# Altium schematic sheet External Power Connectors.SchDoc
size A4; SheetNumber: 16; SheetTotal: 16
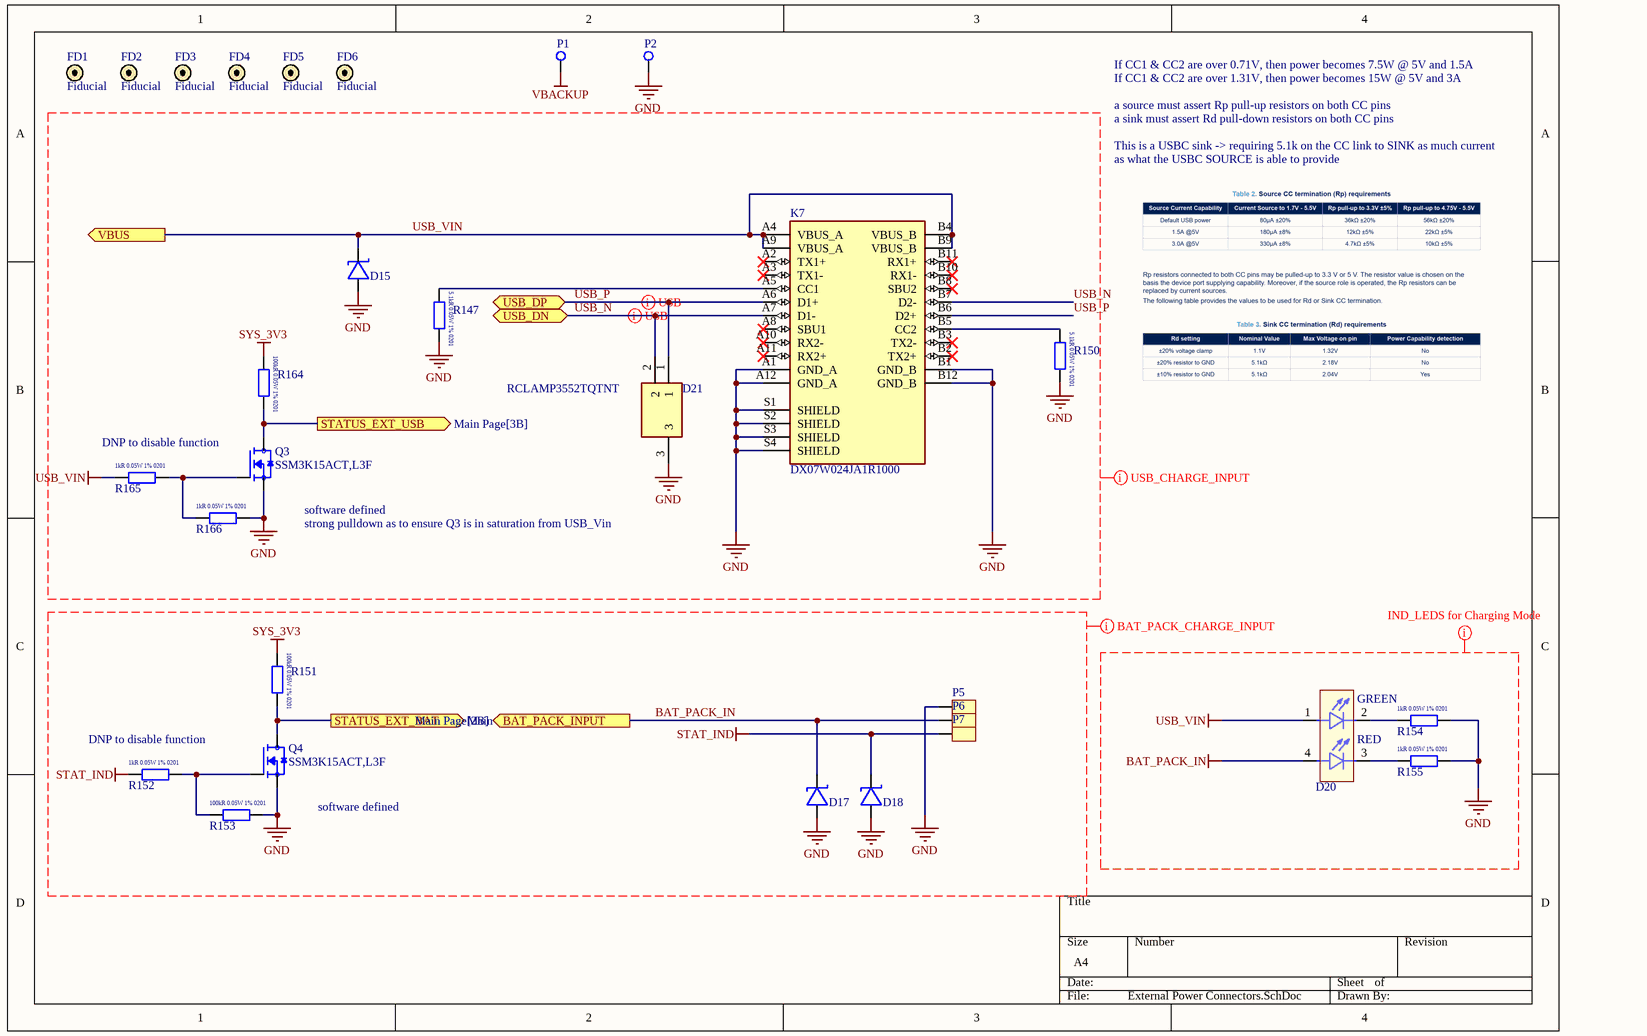
[diagram p0: External Power Connectors.SchDoc]

## Parts
D15  RCLAMP04041PW.C  [RCLAMP04041PW.C]  (value not drawn)
D17  RCLAMP04041PW.C  [RCLAMP04041PW.C]  (value not drawn)
D18  RCLAMP04041PW.C  [RCLAMP04041PW.C]  (value not drawn)
D20  APGB0607G22R23C  [LED_APGB0607G22R23C]  (value not drawn)
D21  RCLAMP3552TQTNT  [RCLAMP3552TQTNT]
FD1  Fiducial  [Fiducial]
FD2  Fiducial  [Fiducial]
FD3  Fiducial  [Fiducial]
FD4  Fiducial  [Fiducial]
FD5  Fiducial  [Fiducial]
FD6  Fiducial  [Fiducial]
K7  DX07W024JA1R1000  [JAE_DX07W024JA1R1000]
P1  Pogo pin Pad  [S70-220101045R]  (value not drawn)
P2  Pogo pin Pad  [S70-220101045R]  (value not drawn)
P5  Pad for Bat  [Pad for Bat]  (value not drawn)
P6  Pad for Bat  [Pad for Bat]  (value not drawn)
P7  Pad for Bat  [Pad for Bat]  (value not drawn)
Q3  SSM3K15ACT,L3F  [SSM3K15ACT]
Q4  SSM3K15ACT,L3F  [SSM3K15ACT]
R147  ERJ-1GNF5101C  [RESC0603X03L]  (value not drawn)
R150  ERJ-1GNF5101C  [RESC0603X03L]  (value not drawn)
R151  ERJ-1GNF1003C  [RESC0603X03L]  (value not drawn)
R152  ERJ-1GNF1001C  [RESC0603X03L]  (value not drawn)
R153  ERJ-1GNF1003C  [RESC0603X03L]  (value not drawn)
R154  ERJ-1GNF1001C  [RESC0603X03L]  (value not drawn)
R155  ERJ-1GNF1001C  [RESC0603X03L]  (value not drawn)
R164  ERJ-1GNF1003C  [RESC0603X03L]  (value not drawn)
R165  ERJ-1GNF1001C  [RESC0603X03L]  (value not drawn)
R166  ERJ-1GNF1001C  [RESC0603X03L]  (value not drawn)

## Ports
BAT_PACK_INPUT (out, see Main Page[2B]), STATUS_EXT_BAT (out, see Main Page[3B]), STATUS_EXT_USB (out, see Main Page[3B]), USB_DN (bidir, see Main Page[3B]), USB_DP (bidir, see Main Page[3B]), VBUS (out, see Main Page[2B])

## Nets
BAT_PACK_IN: D17.2 D20.4(A_RED) P6.1 ; port BAT_PACK_INPUT
GND: D15.1 D17.1 D18.1 D21.3 K7.A1(GND_A) K7.A12(GND_A) K7.B1(GND_B) K7.B12(GND_B) K7.S1(SHIELD) K7.S2(SHIELD) K7.S3(SHIELD) K7.S4(SHIELD) P2.1 P5.1 Q3.3(S) Q4.3(S) R147.2 R150.2 R153.2 R154.2 R155.2 R166.2
STAT_IND: D18.2 P7.1 R152.1
SYS_3V3: R151.1 R164.1
USB_VIN: D15.2 D20.1(A_GREEN) K7.A4(VBUS_A) K7.A9(VBUS_A) K7.B4(VBUS_B) K7.B9(VBUS_B) R165.1 ; port VBUS
VBACKUP: P1.1
STATUS_EXT_BAT: Q4.2(D) R151.2 ; port STATUS_EXT_BAT
STATUS_EXT_USB: Q3.2(D) R164.2 ; port STATUS_EXT_USB
USB_N: D21.2 K7.A7(D1-) K7.B7(D2-) ; port USB_DN
USB_P: D21.1 K7.A6(D1+) K7.B6(D2+) ; port USB_DP
NetD20_2: D20.2(C_GREEN) R154.1
NetD20_3: D20.3(C_RED) R155.1
NetK7_A5: K7.A5(CC1) R147.1
NetK7_B5: K7.B5(CC2) R150.1
NetQ3_1: Q3.1(G) R165.2 R166.1
NetQ4_1: Q4.1(G) R152.2 R153.1

Not connected (* = marked no-connect by the designer): K7 A2(TX1+)* A3(TX1-)* A8(SBU1)* A10(RX2-)* A11(RX2+)* B2(TX2+)* B3(TX2-)* B8(SBU2)* B10(RX1-)* B11(RX1+)*

## Layout directives
differential pair: USB_N, USB_P
net class USB_CHARGE_INPUT: GND, SYS_3V3, USB_N, USB_P, USB_VIN
net class BAT_PACK_CHARGE_INPUT: BAT_PACK_IN, GND, STAT_IND, SYS_3V3
net class IND_LEDS for Charging Mode: BAT_PACK_IN, GND, USB_VIN

## Notes on the sheet
- If CC1 & CC2 are over 0.71V, then power becomes 7.5W @ 5V and 1.5A
- If CC1 & CC2 are over 1.31V, then power becomes 15W @ 5V and 3A
- a source must assert Rp pull-up resistors on both CC pins
- a sink must assert Rd pull-down resistors on both CC pins
- This is a USBC sink -> requiring 5.1k on the CC link to SINK as much current
- as what the USBC SOURCE is able to provide
- (near Q3) DNP to disable function
- software defined
- strong pulldown as to ensure Q3 is in saturation from USB_Vin
- DNP to disable function
- (in symbol APGB0607G22R23C) GREEN; RED
- (in symbol ERJ-1GNF1001C) 1kR 0.05W 1% 0201
- (in symbol ERJ-1GNF1003C) 100kR 0.05W 1% 0201
- (in symbol ERJ-1GNF5101C) 5.1kR 0.05W 1% 0201

## Library data of the parts
D15 D17 D18 = RCLAMP04041PW.C: 8V Clamp 20A (8/20µs) Ipp Tvs Diode Surface Mount 2-DFN (1x0.6); ComponentLink1Description: New link; ComponentLink1URL: https://www.digikey.com.au/en/products/detail/semtech-corporation/RCLAMP04041PW-C/21379403
D20 = APGB0607G22R23C: Green, Red 525nm Green, 624nm Red LED Indication - Discrete 2.85V Green, 1.95V Red 4-SMD, No Lead; ComponentLink1Description: New link; ComponentLink1URL: https://www.digikey.com/en/products/detail/kingbright/APGB0607G22R23C/22561020
D21 = RCLAMP3552TQTNT: TVS Diode (Bi-directional); Manufacturer_Name: SEMTECH; Datasheet Link: https://semtech.my.salesforce.com/sfc/p/#E0000000JelG/a/2R000000UohO/V4d3xrkq_aAf9cXb8fvHnUsEIcun.v6swlyE.QX6HEE; Height: 0.43mm; Manufacturer_Part_Number: RCLAMP3552TQTNT; Mouser Part Number: 947-RCLAMP3552TQTNT; Mouser Price/Stock: https://www.mouser.co.uk/ProductDetail/Semtech/RCLAMP3552TQTNT?qs=gTYE2QTfZfQzabe3OC25DQ%3D%3D; Arrow Part Number: RCLAMP3552TQTNT; Arrow Price/Stock: https://www.arrow.com/en/products/rclamp3552tqtnt/semtech?utm_currency=USD&region=nac
K7 = DX07W024JA1R1000: USB-C (USB TYPE-C) USB 3.2 Gen 2 (USB 3.1 Gen 2, Superspeed + (USB 3.1)) Receptacle Connector 24 Position Board Edge, Surface Mount, Right Angle; MF: JAE Electronics; SnapEDA_Link: https://www.snapeda.com/parts/DX07W024JA1R1000/JAE+Electronics/view-part/?ref=snap; Package: None; Value: *; MP: DX07W024JA1R1000; Check_prices: https://www.snapeda.com/parts/DX07W024JA1R1000/JAE+Electronics/view-part/?ref=eda; ComponentLink1Description: New link; ComponentLink1URL: https://www.digikey.com.au/en/products/detail/jae-electronics/DX07W024JA1R1000/9646471
P1 P2 = Pogo pin Pad: Contact Spring Surface Mount
Q3 Q4 = SSM3K15ACT,L3F: N-Channel 30 V 100mA (Ta) 100mW (Ta) Surface Mount CST3; ComponentLink1Description: New link; ComponentLink1URL: https://www.digikey.com.au/en/products/detail/toshiba-semiconductor-and-storage/SSM3K15ACT-L3F/5298026
R147 R150 = ERJ-1GNF5101C: 5.1 kOhms ±1% 0.05W, 1/20W Chip Resistor 0201 (0603 Metric) Thick Film; ComponentLink1Description: New link; ComponentLink1URL: https://www.digikey.com.au/en/products/detail/panasonic-electronic-components/ERJ-1GNF5101C/2036192
R151 R153 R164 = ERJ-1GNF1003C: 100 kOhms ±1% 0.05W, 1/20W Chip Resistor 0201 (0603 Metric) Thick Film; ComponentLink1Description: New link; ComponentLink1URL: https://www.digikey.com.au/en/products/detail/panasonic-electronic-components/ERJ-1GNF1003C/2036340
R152 R154 R155 R165 R166 = ERJ-1GNF1001C: 1 kOhms ±1% 0.05W, 1/20W Chip Resistor 0201 (0603 Metric) Thick Film